# EasyEDA Pro project FOC_Driver.eprj

# Schematic Schematic1

## Sheets
1 DRV8301: Create Date: 2023-03-30; Page Name: DRV8301; Project Name: FOC_Driver; Schematic Name: Schematic1; Update Date: 2023-03-30; Company: 嘉立创EDA; Page Size: A3; Version: V1.0
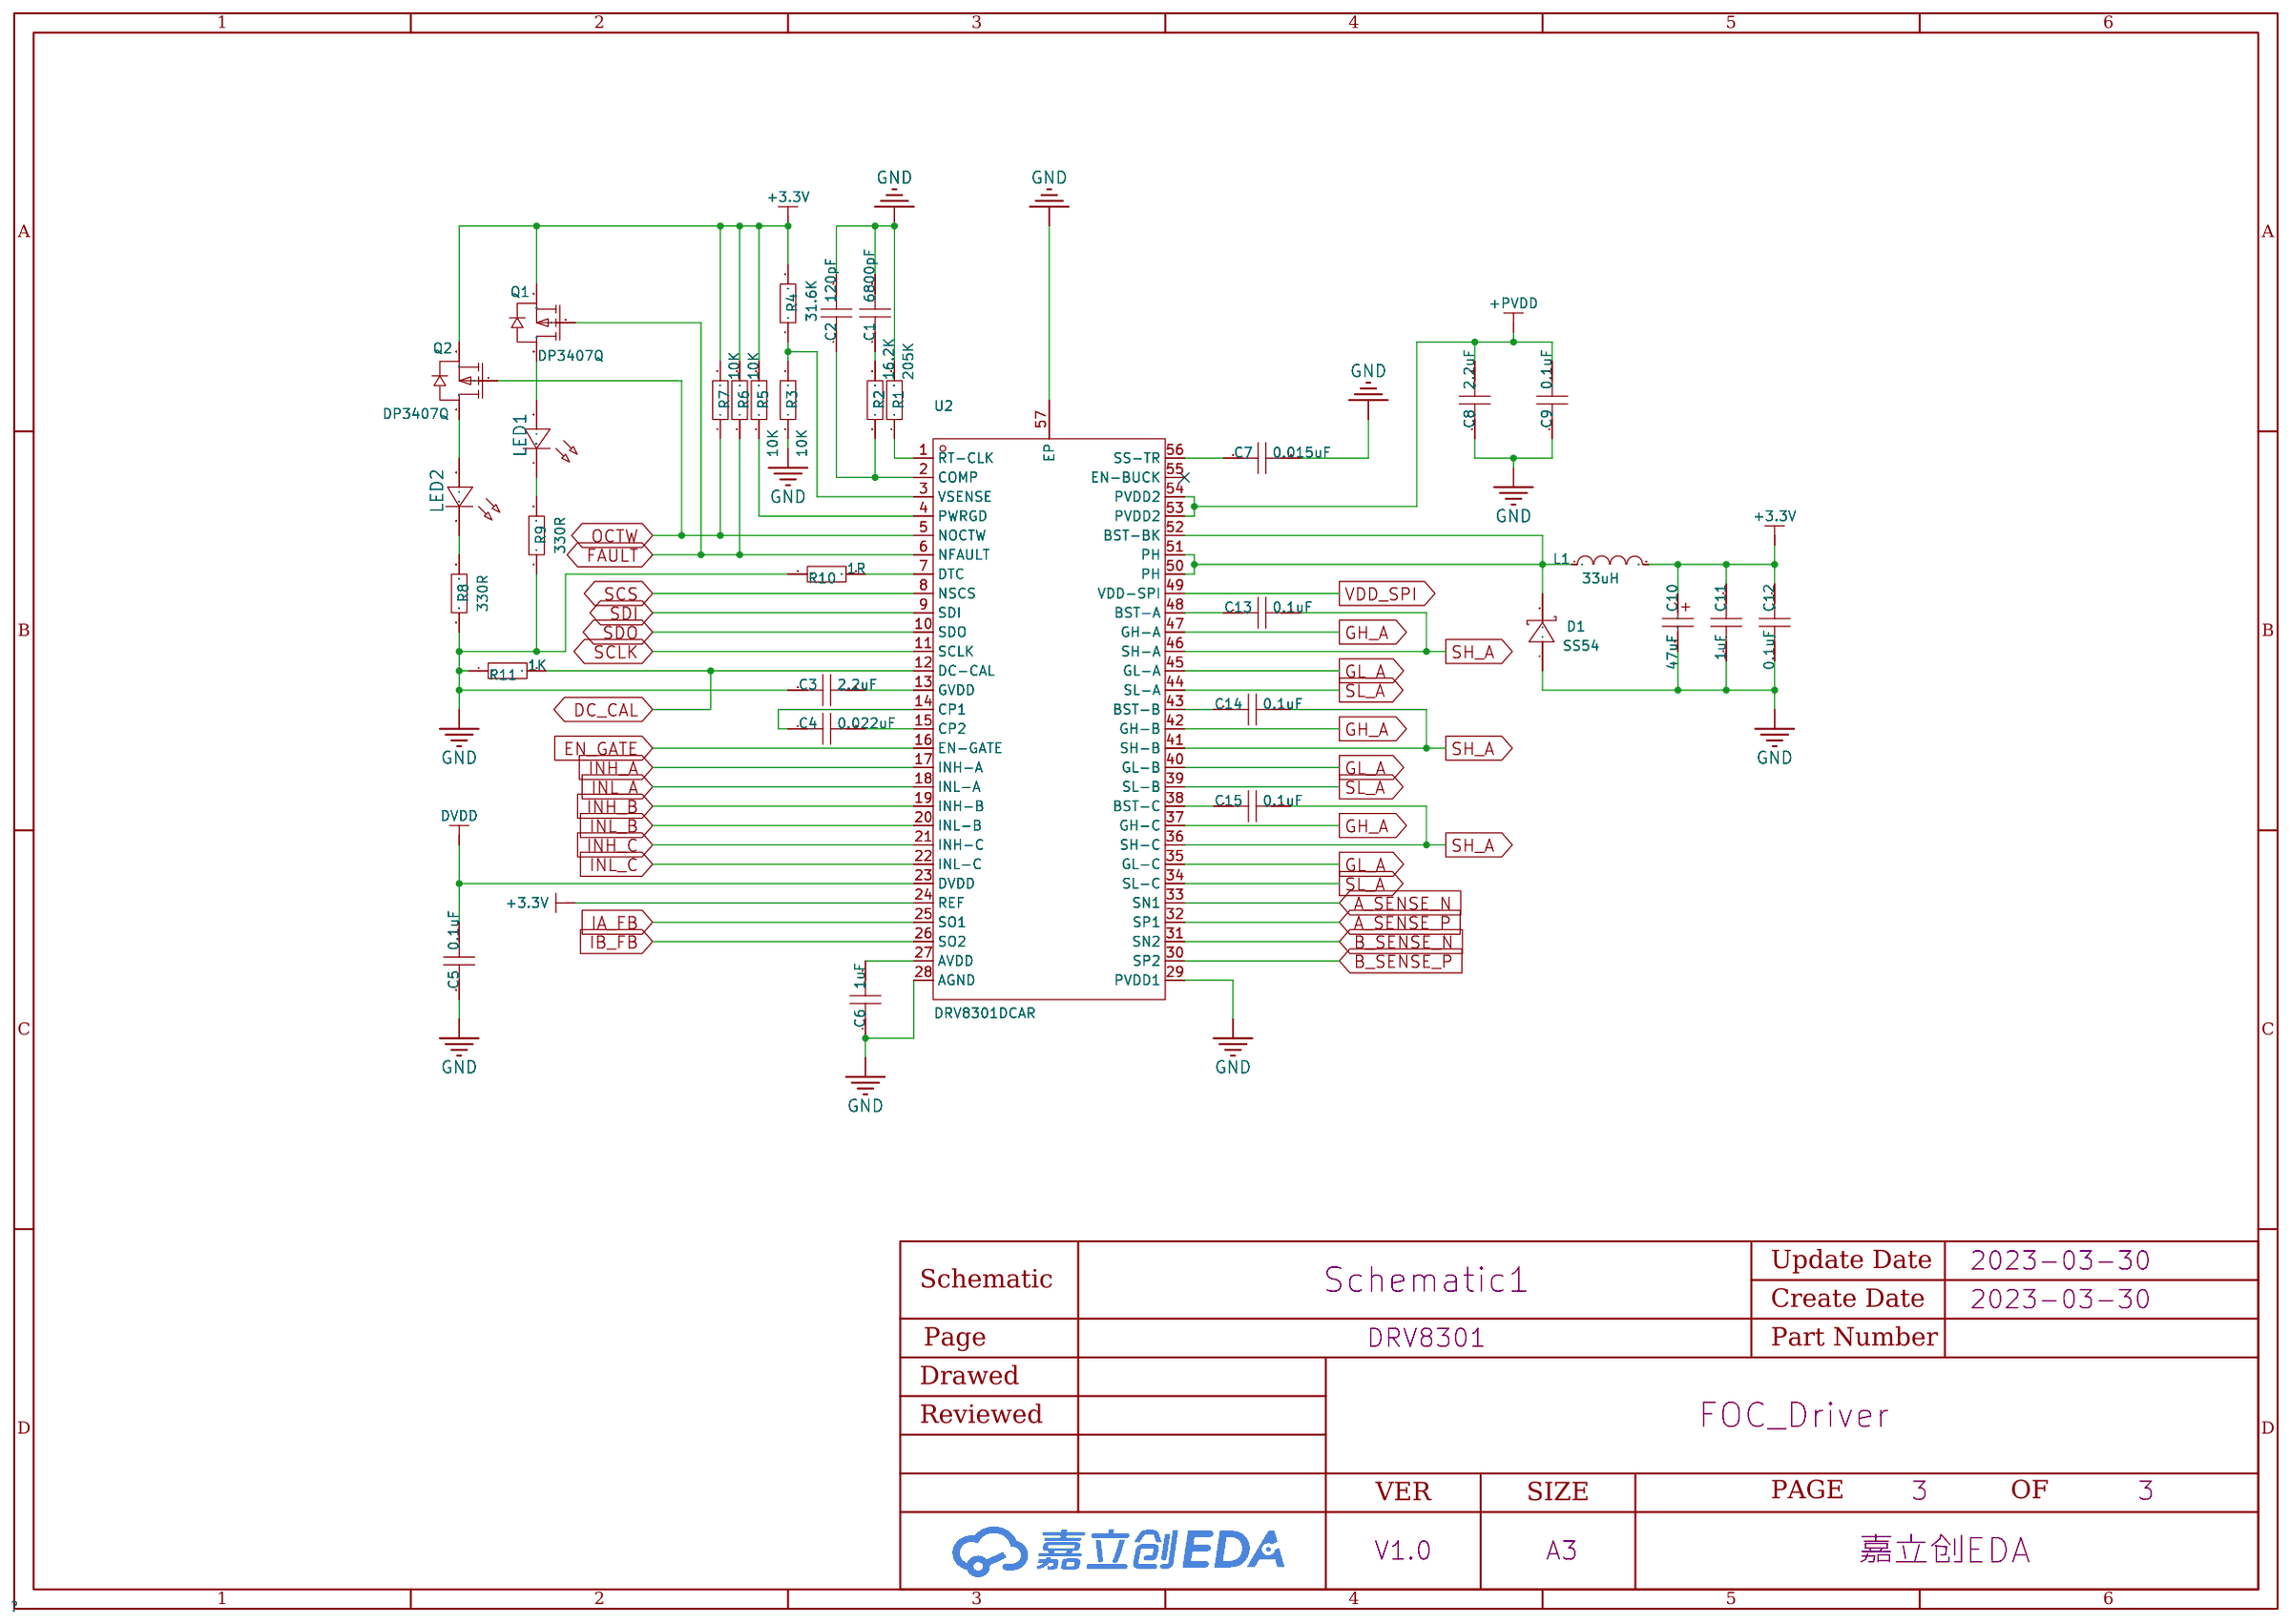
[diagram p0: DRV8301]
2 MOSFET: Create Date: 2023-04-06; Page Name: MOSFET; Update Date: 2023-04-06
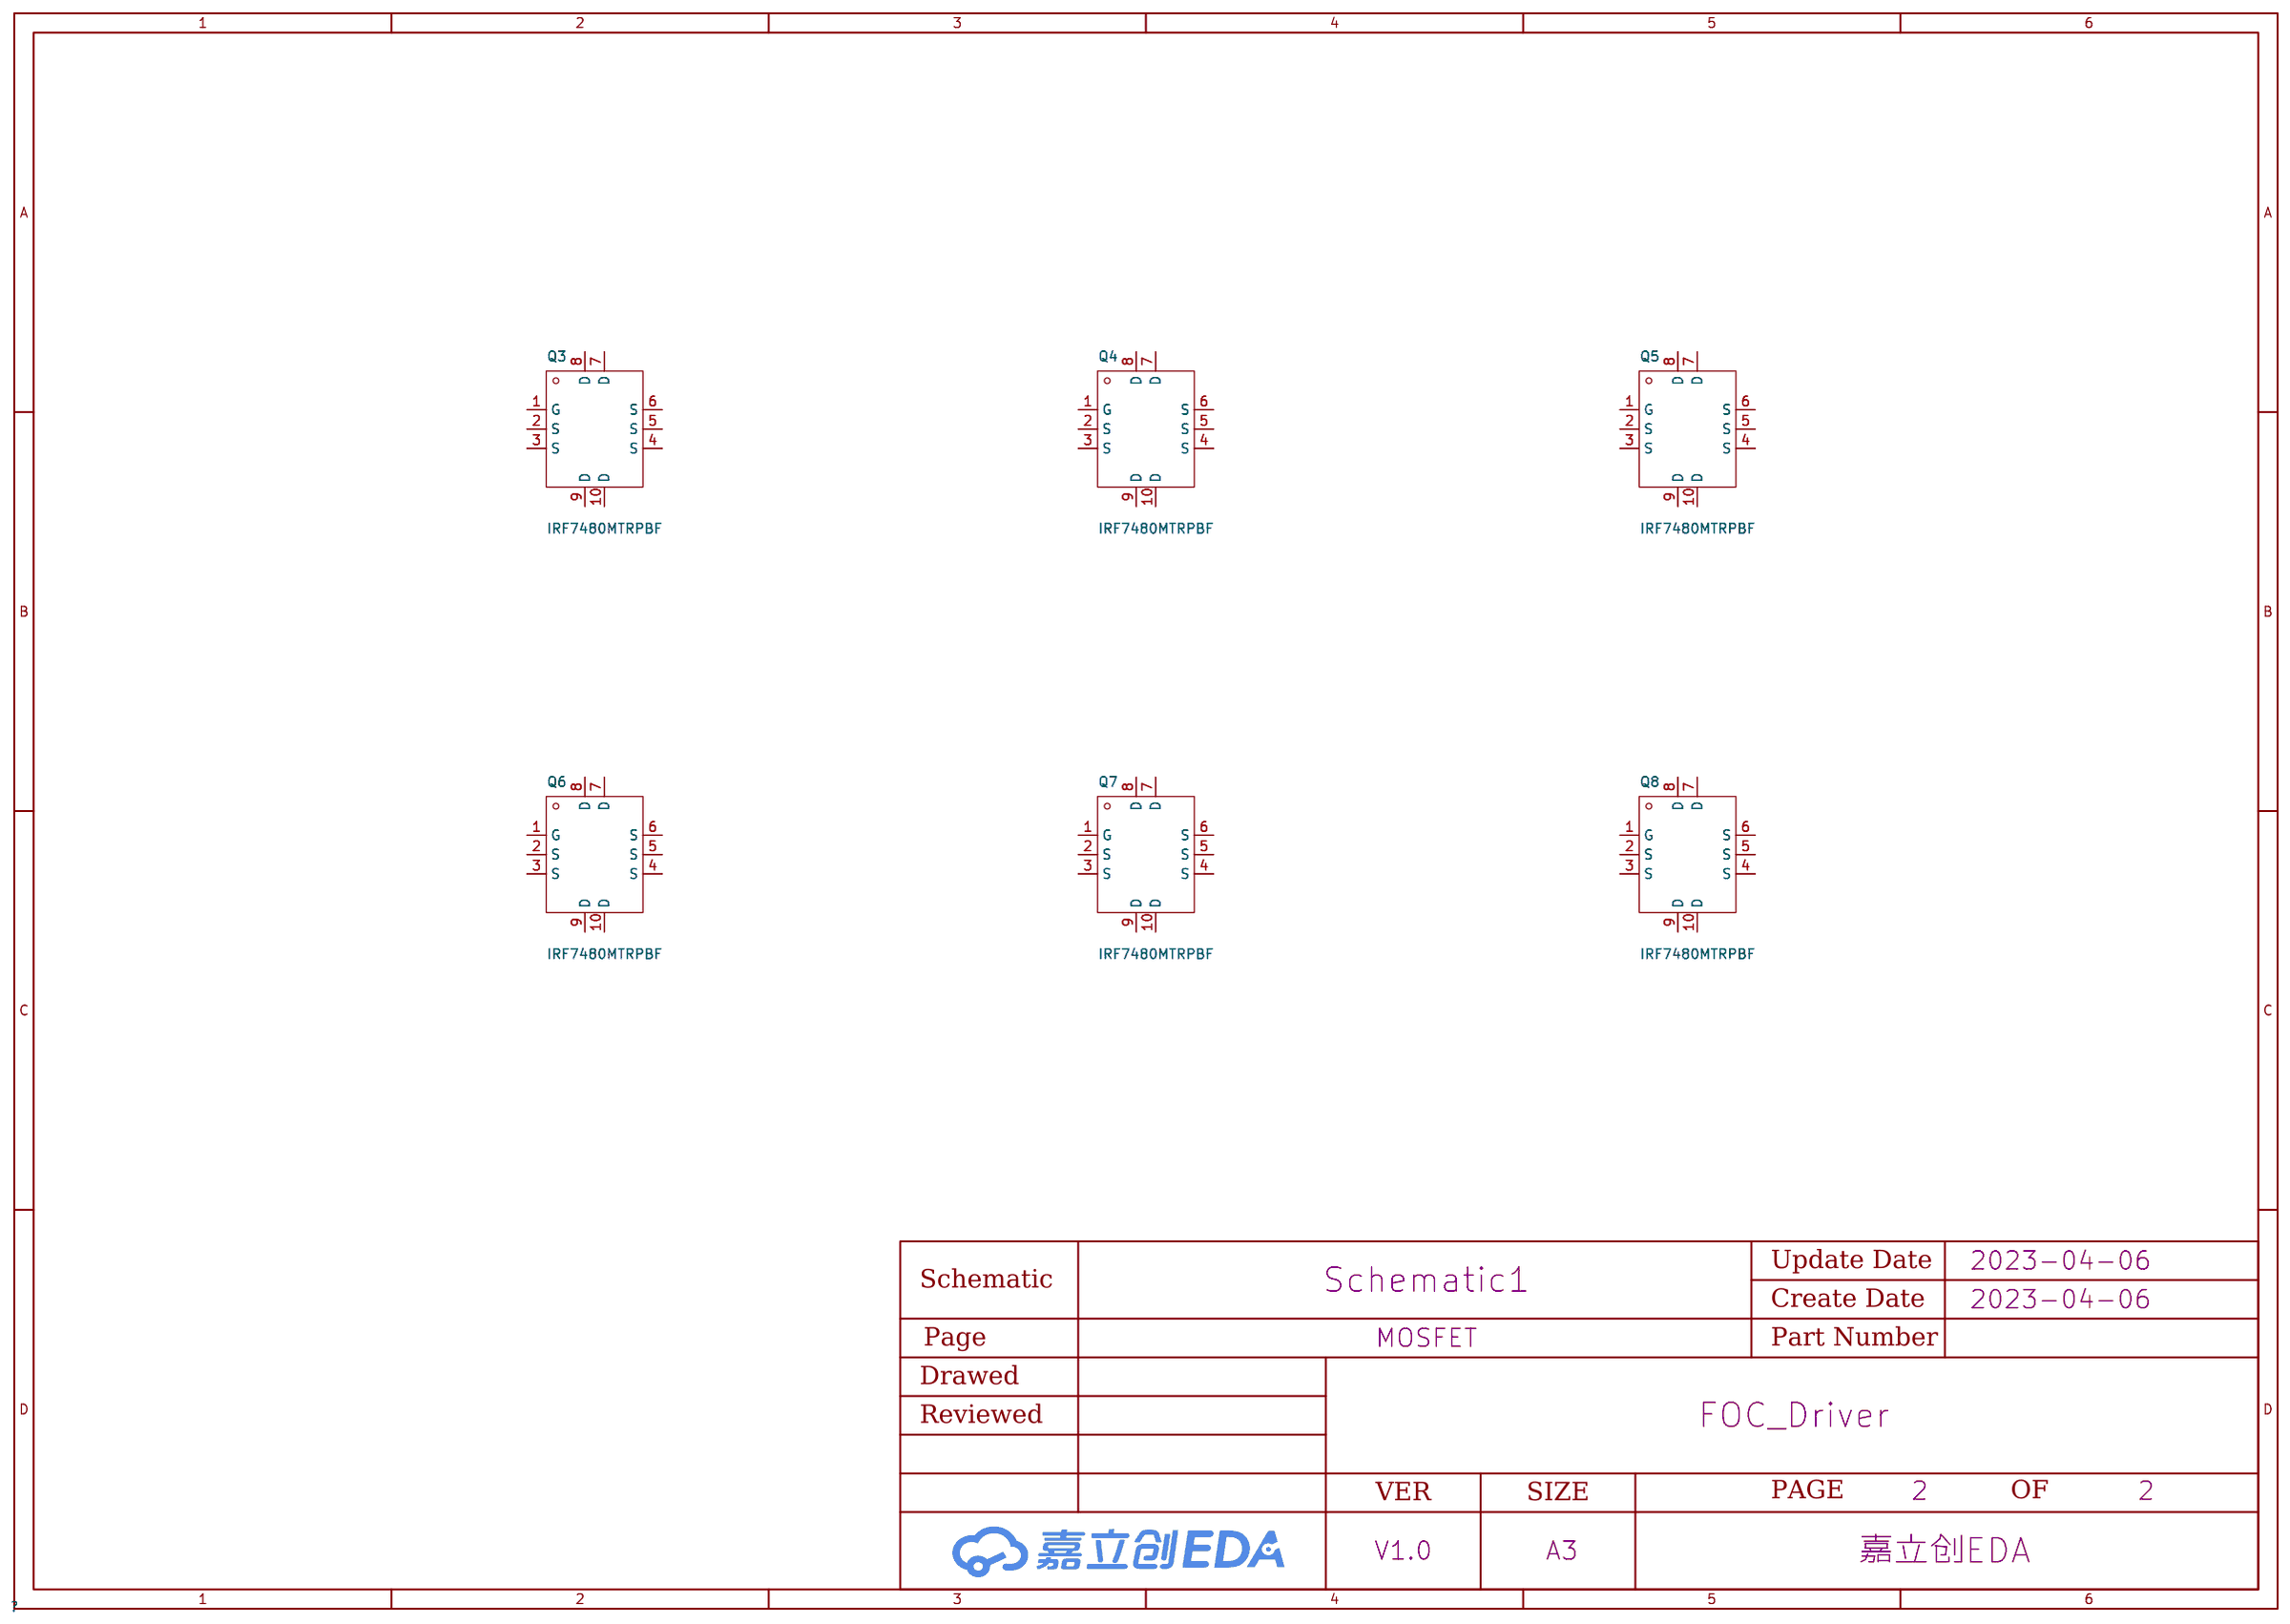
[diagram p1: MOSFET]

## Parts
sheet DRV8301
C1  6800pF  [C0603]
C2  120pF  [C0603]
C3  2.2uF  [C0603]
C4  0.022uF  [C0603]
C5  0.1uF  [C0603]
C6  1uF  [C0603]
C7  0.015uF  [C0603]
C8  2.2uF  [C0603]
C9  0.1uF  [C0603]
C10  47uF  [C_Ele_SMD_3x5.4mm]
C11  1uF  [C0603]
C12  0.1uF  [C0603]
C13  0.1uF  [C0603]
C14  0.1uF  [C0603]
C15  0.1uF  [C0603]
D1  SS54  [SMA_L4.4-W2.8-LS5.4-R-RD]
L1  33uH  [L0603]
LED1  -  [LED_0603]
LED2  -  [LED_0603]
Q1  DP3407Q  [SOT-23-3L_L2.9-W1.6-P1.90-LS2.8-BL]
Q2  DP3407Q  [SOT-23-3L_L2.9-W1.6-P1.90-LS2.8-BL]
R1  205K  [R0603]
R2  16.2K  [R0603]
R3  10K  [R0603]
R4  31.6K  [R0603]
R5  10K  [R0603]
R6  10K  [R0603]
R7  10K  [R0603]
R8  330R  [R0603]
R9  330R  [R0603]
R10  1R  [R0603]
R11  1K  [R0603]
U2  DRV8301DCAR  [HTSSOP-56_L14.0-W6.0-P0.50-LS8.0-BL]
sheet MOSFET
Q3  IRF7480MTRPBF  [TRS-SMD_IRF7480MTRPBF]
Q4  IRF7480MTRPBF  [TRS-SMD_IRF7480MTRPBF]
Q5  IRF7480MTRPBF  [TRS-SMD_IRF7480MTRPBF]
Q6  IRF7480MTRPBF  [TRS-SMD_IRF7480MTRPBF]
Q7  IRF7480MTRPBF  [TRS-SMD_IRF7480MTRPBF]
Q8  IRF7480MTRPBF  [TRS-SMD_IRF7480MTRPBF]

## Library data of the parts
C1-C9 C11-C15 = CAP_0603: Supplier Footprint: 0603
C10 = C_Ele_SMD_3x5.4mm: Supplier Footprint: SMD,3x5.4mm
D1 = SS54_C22452: 直流反向耐压(Vr):40V;平均整流电流(Io):5A;正向压降(Vf):550mV@5A;; LCSC Part Name: 40V 5A 550mV@5A; Supplier Part: C22452; Manufacturer: MDD; Supplier Footprint: SMA(DO-214AC); JLCPCB Part Class: Basic Part; Datasheet: https://atta.szlcsc.com/upload/public/pdf/source/20230314/529CD85F9B31F69841D3A079BC07E377.pdf; Supplier: LCSC; Reverse Voltage (Vr): 40V; Average Rectified Current (Io): 5A; Forward Voltage (Vf@If): 550mV@5A
L1 = L_0603
LED1 LED2 = LED_0603-R: Supplier Footprint: 0603
Q1 Q2 = DP3407Q: LCSC Part Name: PMOS -30V -4.1A RDS(on)=60mΩ; Supplier Part: C2931754; Manufacturer: Doeshare(德芯); Supplier Footprint: SOT-23-3L; JLCPCB Part Class: Extended Part; Datasheet: https://atta.szlcsc.com/upload/public/pdf/source/20220104/F02062DD0E8B77D82655375EAD6DD144.pdf; Supplier: LCSC
R1-R11 = Res_0603: Supplier Footprint: 0603
U2 = DRV8301DCAR: 电源电压:6V~60V;输出电流:-;接口:SPI,STEP/DIR;; Supplier Part: C98969; Manufacturer: TI(德州仪器); Supplier Footprint: HTSSOP-56-6mm; JLCPCB Part Class: Extended Part; Datasheet: https://atta.szlcsc.com/upload/public/pdf/source/20180716/C98969_BB8CF07B1892F5E66C75CBC0D9FDECDB.pdf; Supplier: LCSC; Type: 无刷直流BLDC; Supply Voltage: 6V~60V; Interface: SPI,STEP/DIR; Operating Temperature: -40℃~+125℃@(Ta)
Q3-Q8 = IRF7480MTRPBF: 类型:N沟道;漏源电压(Vdss):40V;连续漏极电流(Id):217A;功率(Pd):96W;导通电阻(RDS(on)@Vgs,Id):1.2mΩ@10V,132A;阈值电压(Vgs(th)@Id):3.9V@150uA;; LCSC Part Name: N沟道 40V 217A; Supplier Part: C152356; Manufacturer: Infineon(英飞凌); Supplier Footprint: DirectFET; JLCPCB Part Class: Extended Part; Datasheet: https://atta.szlcsc.com/upload/public/pdf/source/20180112/C152356_15157256875111261501.pdf; Supplier: LCSC; Type: N沟道; Drain Source Voltage (Vdss): 40V; Continuous Drain Current (Id): 217A; Power Dissipation (Pd): 96W; Drain Source On Resistance (RDS(on)@Vgs,Id): 1.2mΩ@10V,132A; Gate Threshold Voltage (Vgs(th)@Id): 3.9V@150uA

## Nets
+3.3V: C10.1 C11.2 C12.2 L1.2 Q1.2(S) Q2.2(S) R4.2 R5.2 R6.2 R7.2 U2.24(REF)
+PVDD: C8.2 C9.2 U2.53(PVDD2) U2.54(PVDD2)
DVDD: C5.2 U2.23(DVDD)
GND: C1.2 C2.2 C3.1 C5.1 C6.1 C7.2 C8.1 C9.1 C10.2 C11.1 C12.1 D1.1(A) R1.2 R3.1 R8.1 R9.1 R10.1 R11.1 U2.28(AGND) U2.29(PVDD1) U2.57(EP)
VDD_SPI: U2.49(VDD-SPI)
A_SENSE_N: U2.33(SN1)
A_SENSE_P: U2.32(SP1)
B_SENSE_N: U2.31(SN2)
B_SENSE_P: U2.30(SP2)
DC_CAL: R11.2 U2.12(DC-CAL)
EN_GATE: U2.16(EN-GATE)
FAULT: Q1.1(G) R6.1 U2.6(NFAULT)
GH_A: U2.37(GH-C) U2.42(GH-B) U2.47(GH-A)
GL_A: U2.35(GL-C) U2.40(GL-B) U2.45(GL-A)
IA_FB: U2.25(SO1)
IB_FB: U2.26(SO2)
INH_A: U2.17(INH-A)
INH_B: U2.19(INH-B)
INH_C: U2.21(INH-C)
INL_A: U2.18(INL-A)
INL_B: U2.20(INL-B)
INL_C: U2.22(INL-C)
OCTW: Q2.1(G) R7.1 U2.5(NOCTW)
SCLK: U2.11(SCLK)
SCS: U2.8(NSCS)
SDI: U2.9(SDI)
SDO: U2.10(SDO)
SH_A: C13.2 C14.2 C15.2 U2.36(SH-C) U2.41(SH-B) U2.46(SH-A)
SL_A: U2.34(SL-C) U2.39(SL-B) U2.44(SL-A)
Net-(C1-1): C1.1 R2.2
Net-(C2-1): C2.1 R2.1 U2.2(COMP)
Net-(C3-2): C3.2 U2.13(GVDD)
Net-(C4-1): C4.1 U2.14(CP1)
Net-(C4-2): C4.2 U2.15(CP2)
Net-(C6-2): C6.2 U2.27(AVDD)
Net-(C7-1): C7.1 U2.56(SS-TR)
Net-(C13-1): C13.1 U2.48(BST-A)
Net-(C14-1): C14.1 U2.43(BST-B)
Net-(C15-1): C15.1 U2.38(BST-C)
Net-(D1-2): D1.2(K) L1.1 U2.50(PH) U2.51(PH) U2.52(BST-BK)
Net-(LED1-1): LED1.1(C) R9.2
Net-(LED1-2): LED1.2(A) Q1.3(D)
Net-(LED2-1): LED2.1(C) R8.2
Net-(LED2-2): LED2.2(A) Q2.3(D)
Net-(R1-1): R1.1 U2.1(RT-CLK)
Net-(R3-2): R3.2 R4.1 U2.3(VSENSE)
Net-(R5-1): R5.1 U2.4(PWRGD)
Net-(R10-2): R10.2 U2.7(DTC)

Not connected (* = marked no-connect by the designer): Q3 1(G) 2(S) 3(S) 4(S) 5(S) 6(S) 7(D) 8(D) 9(D) 10(D); Q4 1(G) 2(S) 3(S) 4(S) 5(S) 6(S) 7(D) 8(D) 9(D) 10(D); Q5 1(G) 2(S) 3(S) 4(S) 5(S) 6(S) 7(D) 8(D) 9(D) 10(D); Q6 1(G) 2(S) 3(S) 4(S) 5(S) 6(S) 7(D) 8(D) 9(D) 10(D); Q7 1(G) 2(S) 3(S) 4(S) 5(S) 6(S) 7(D) 8(D) 9(D) 10(D); Q8 1(G) 2(S) 3(S) 4(S) 5(S) 6(S) 7(D) 8(D) 9(D) 10(D); U2 55(EN-BUCK)*
